# EAGLE design DMMRectifier_v2 (EAGLE 9.7.0)
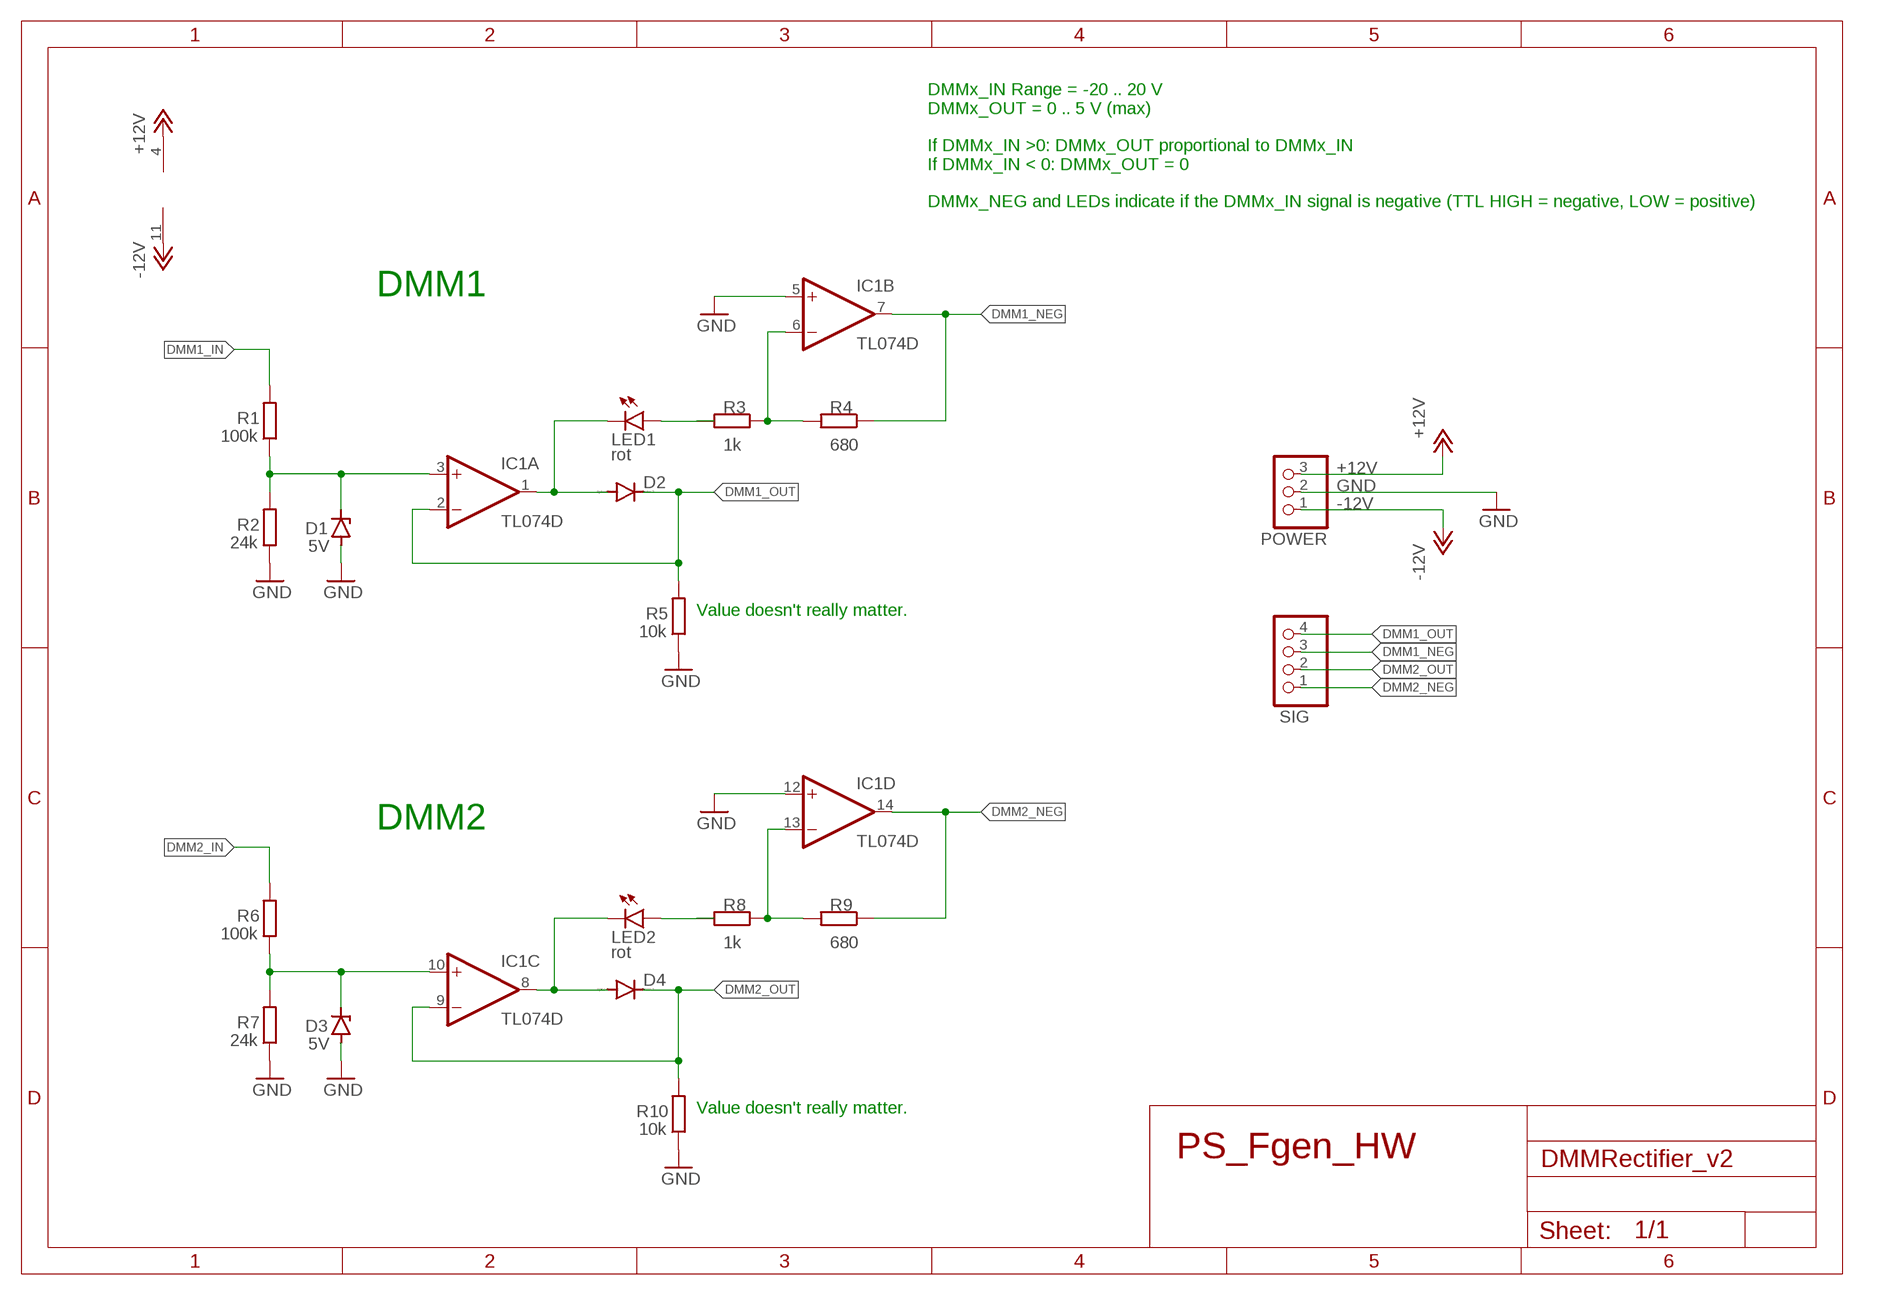
[diagram p0: schematic, sheet 1]

## Parts
D1  5V  ZENER-DIODESOD80C  [SOD80C]
D2  DIODE-SOD80C  [SOD80C]
D3  5V  ZENER-DIODESOD80C  [SOD80C]
D4  DIODE-SOD80C  [SOD80C]
IC1  TL074D  [SO14]
LED1  rot  LEDCHIPLED_0603  [CHIPLED_0603]
LED2  rot  LEDCHIPLED_0603  [CHIPLED_0603]
POWER  PINHD-1X3  [1X03]
R1  100k  R-EU_R0805  [R0805]
R2  24k  R-EU_R0805  [R0805]
R3  1k  R-EU_R0805  [R0805]
R4  680  R-EU_R0805  [R0805]
R5  10k  R-EU_R0805  [R0805]
R6  100k  R-EU_R0805  [R0805]
R7  24k  R-EU_R0805  [R0805]
R8  1k  R-EU_R0805  [R0805]
R9  680  R-EU_R0805  [R0805]
R10  10k  R-EU_R0805  [R0805]
SIG  PINHD-1X4  [1X04]

## Nets
+12V: IC1.4(P:V+) POWER.3
-12V: IC1.11(P:V-) POWER.1
DMM1_IN: R1.2
DMM1_NEG: IC1.7(B:OUT) R4.1 SIG.3
DMM1_OUT: D2.C IC1.2(A:-IN) R5.2 SIG.4
DMM2_IN: R6.2
DMM2_NEG: IC1.14(D:OUT) R9.1 SIG.1
DMM2_OUT: D4.C IC1.9(C:-IN) R10.2 SIG.2
GND: D1.A D3.A IC1.5(B:+IN) IC1.12(D:+IN) POWER.2 R2.1 R5.1 R7.1 R10.1
N$1: D1.C IC1.3(A:+IN) R1.1 R2.2
N$2: D3.C IC1.10(C:+IN) R6.1 R7.2
N$3: IC1.6(B:-IN) R3.1 R4.2
N$4: D2.A IC1.1(A:OUT) LED1.C
N$5: LED1.A R3.2
N$6: IC1.13(D:-IN) R8.1 R9.2
N$7: D4.A IC1.8(C:OUT) LED2.C
N$8: LED2.A R8.2

## Notes on the sheet
- DMMx_IN Range = -20 .. 20 V
  DMMx_OUT = 0 .. 5 V (max)
  
  If DMMx_IN >0: DMMx_OUT proportional to DMMx_IN
  If DMMx_IN < 0: DMMx_OUT = 0
  
  DMMx_NEG and LEDs indicate if the DMMx_IN signal is negative (TTL HIGH = negative, LOW = positive)
- DMM1
- Value doesn't really matter.
- DMM2
- Value doesn't really matter.
- PS_Fgen_HW

## Library data of the parts
D1 D3 = diode:ZENER-DIODE: Z-Diode
D2 D4 = diode:DIODE-: DIODE
IC1 = linear:TL074: OP AMP; SPICEPREFIX: I
LED1 LED2 = OwnDevices:LED: LED OSRAM: - CHIPLED LG R971, LG N971, LY N971, LG Q971, LY Q971, LO R971, LY R971 LH N974, LH R974 LS Q976, LO Q976, LY Q976 LO Q996 - Hyper CHIPLED LW Q18S LB Q993, LB Q99A, LB R99A - SideLED LS A670, LO A670, LY A670, LG A670, LP A670 LB A673, LV A673, LT A673, LW A673 LH A674 LY A675 LS A676, LA A676, LO A676, LY A676, LW A676 LS A679, LY A679, LG A679 - Hyper Micro SIDELED® LS Y876, LA Y876, LO Y876, LY Y876 LT Y87S - SmartLED LW L88C, LW L88S LB L89C, LB L89S, LG L890 LS L89K, LO L89K, LY L89K LS L896, LA L896, LO L896, LY L896 - TOPLED LS T670, LO T670, LY T670, LG T670, LP T670 LSG T670, LSP T670, LSY T670, LOP T670, LYG T670 LG T671, LOG T671, LSG T671 LB T673, LV T673, LT T673, LW T673 LH T674 LS T676, LA T676, LO T676, LY T676, LB T676, LH T676, LSB T676, LW T676 LB T67C, LV T67C, LT T67C, LS T67K, LO T67K, LY T67K, LW E67C LS E67B, LA E67B, LO E67B, LY E67B, LB E67C, LV E67C, LT E67C LW T67C LS T679, LY T679, LG T679 LS T770, LO T770, LY T770, LG T770, LP T770 LB T773, LV T773, LT T773, LW T773 LH T774 LS E675, LA E675, LY E675, LS T675 LS T776, LA T776, LO T776, LY T776, LB T776 LHGB T686 LT T68C, LB T68C - Hyper Mini TOPLED® LB M676 - Mini TOPLED Santana® LG M470 LS M47K, LO M47K, LY M47K Source: http://www.osram.convergy.de LUXEON: - LUMILED® LXK2-PW12-R00, LXK2-PW12-S00, LXK2-PW14-U00, LXK2-PW14-V00 LXK2-PM12-R00, LXK2-PM12-S00, LXK2-PM14-U00 LXK2-PE12-Q00, LXK2-PE12-R00, LXK2-PE12-S00, LXK2-PE14-T00, LXK2-PE14-U00 LXK2-PB12-K00, LXK2-PB12-L00, LXK2-PB12-M00, LXK2-PB14-N00, LXK2-PB14-P00, LXK2-PB14-Q00 LXK2-PR12-L00, LXK2-PR12-M00, LXK2-PR14-Q00, LXK2-PR14-R00 LXK2-PD12-Q00, LXK2-PD12-R00, LXK2-PD12-S00 LXK2-PH12-R00, LXK2-PH12-S00 LXK2-PL12-P00, LXK2-PL12-Q00, LXK2-PL12-R00 Source: www.luxeon.com KINGBRIGHT: KA-3528ASYC Source: www.kingbright.com
POWER = pinhead:PINHD-1X3: PIN HEADER
R1-R10 = OwnDevices:R-EU_: RESISTOR, European symbol; SPICEPREFIX: R
SIG = pinhead:PINHD-1X4: PIN HEADER

## Net classes
0 default: width 0.508 mm

## Board
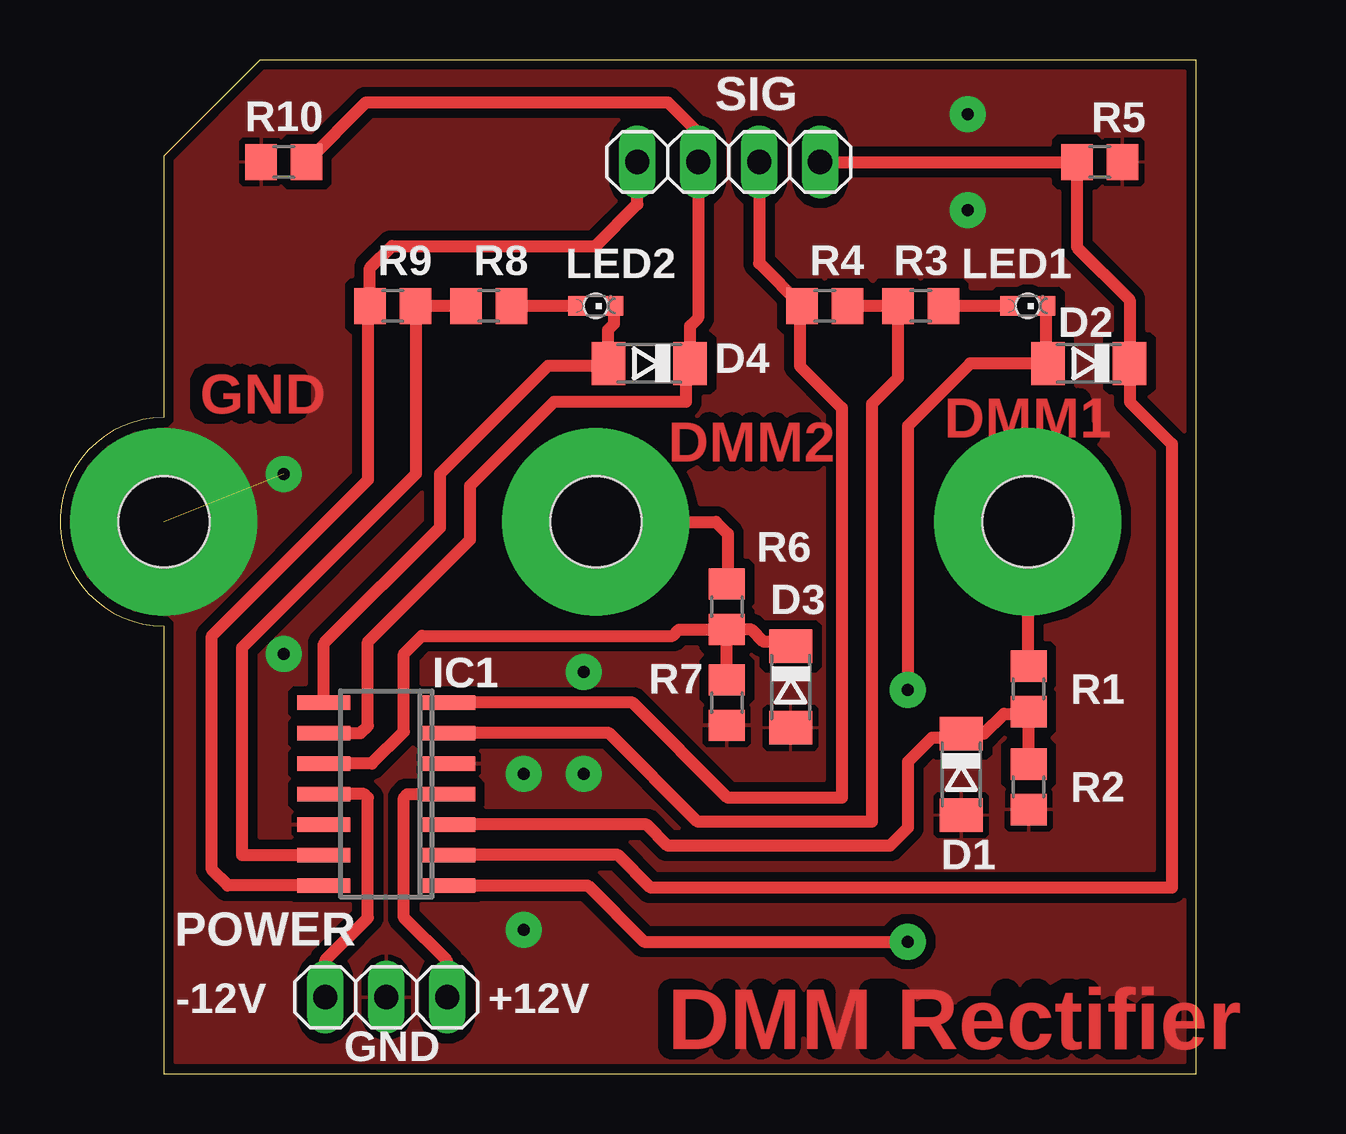
[diagram p1: board, top side]
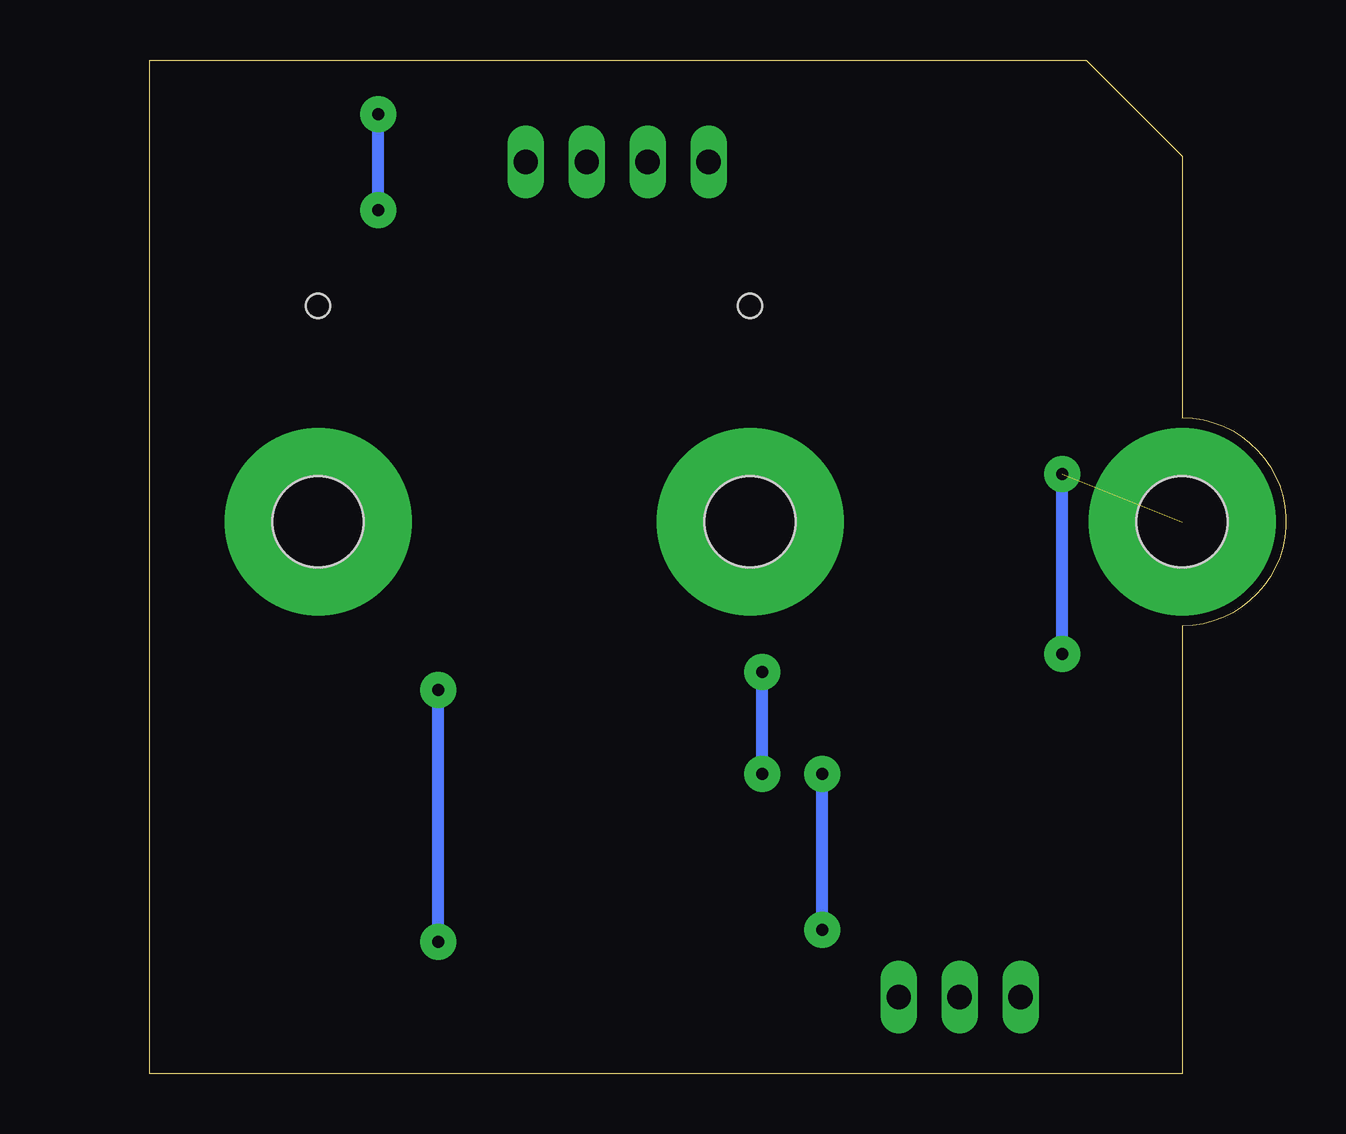
[diagram p2: board, bottom side, seen from below]

Size 47.34 x 42.25 mm. Coordinates in mm from the lower left corner, seen from the top.
Outline: 4.32,38.25 4.32,27.34 arc180 4.32,18.66 4.32,0 47.34,0 47.34,42.25 8.32,42.25 4.32,38.25
Copper layers (1*16): Top / Bottom
Stack-up Default Layer Stack: Top User Defined 0.035mm / Dielectric-1 User Defined 1.5mm / Bottom User Defined 0.035mm
Design rules: minimum copper width class=0 20mil, minimum copper width 10mil, minimum drill size 0.35mm, copper clearance wire_polygon to wire_polygon 10mil, copper clearance wire_polygon to pad_smd 10mil, copper clearance wire_polygon to via 10mil, copper clearance pad_smd to pad_smd 10mil, copper clearance pad_smd to via 10mil, copper clearance via to via 10mil, copper clearance smd to pad (same net) 10mil, copper clearance smd to via (same net) 10mil, copper clearance smd to smd (same net) 6mil, dimension clearance 5mil, via restrict clearance 0mil, restrict clearance 0mil, drill distance 6mil, keepout clearance 0mil
Holes 3.8 mm at 4.34,23 40.34,23 22.34,23
Holes 1 mm at 22.32,32 40.32,32

### Footprints (pad centres in the part's own frame; a part is rotated, then mirrored left to right if it is on the bottom)
SOD80C = smd 1.4 x 1.8: A 1.7,0; C -1.7,0
SO14 = smd 0.6 x 2.2: 1 -3.81,-2.6; 2 -2.54,-2.6; 3 -1.27,-2.6; 4 0,-2.6; 5 1.27,-2.6; 6 2.54,-2.6; 7 3.81,-2.6; 8 3.81,2.6; 9 2.54,2.6; 10 1.27,2.6; 11 0,2.6; 12 -1.27,2.6; 13 -2.54,2.6; 14 -3.81,2.6
CHIPLED_0603 = smd 0.8 x 0.8: A 0,-0.75; C 0,0.75
1X03 = drill 1.016 long: 1 -2.54,0; 2 0,0; 3 2.54,0
R0805 = smd 1.3 x 1.5: 1 -0.95,0; 2 0.95,0
1X04 = drill 1.016 long: 1 -3.81,0; 2 -1.27,0; 3 1.27,0; 4 3.81,0

### Placement (x,y rotation side)
D1  37.55,12.47 270 top
D2  42.86,29.6 180 top
D3  30.44,16.11 270 top
D4  24.55,29.6 180 top
IC1  13.59,11.65 90 top
LED1  40.32,32 270 top
LED2  22.32,32 270 top
POWER  13.59,3.18 0 top
R1  40.36,16.03 90 top
R2  40.36,11.95 90 top
R3  35.86,32 0 top
R4  31.86,32 0 top
R5  43.32,38 180 top
R6  27.78,19.46 90 top
R7  27.78,15.46 90 top
R8  17.86,32 0 top
R9  13.86,32 0 top
R10  9.32,38 0 top
SIG  27.86,38 0 top

### Tracks (layer width: path | path; a pad name or v marks a point on that pad's centre or on a via)
+12V
  Top 0.508: POWER.3 16.13,4.69 14.32,6.5 14.32,11.5 14.47,11.65 IC1.4
-12V
  Top 0.508: POWER.1 11.05,4.73 12.82,6.5 12.82,11.5 12.67,11.65 IC1.11
DMM1_IN  (via drill 3.8 pad 7.8)
  Top 0.508: v40.32,23 40.32,17.02 R1.2
DMM1_NEG
  Top 0.508: SIG.3 29.13,33.78 R4.1 30.82,31.75 30.82,29.5 32.57,27.75 32.57,11.5 27.82,11.5 23.86,15.46 IC1.7
DMM1_OUT
  Top 0.508: SIG.4 R5.2 42.37,34.45 44.56,32.26 D2.C 44.57,29.5 44.57,28 46.32,26.25 46.32,7.75 24.62,7.75 23.26,9.11 IC1.2
DMM2_IN  (via drill 3.8 pad 7.8)
  Top 0.508: v22.32,23 27.32,23 27.82,22.5 27.82,20.45 R6.2
DMM2_NEG
  Top 0.508: SIG.1 24.05,36.23 22.32,34.5 13.82,34.5 12.91,33.59 R9.1 12.82,31.75 12.82,24.75 6.32,18.25 6.32,8.5 6.98,7.84 IC1.14
DMM2_OUT
  Top 0.508: R10.2 12.75,40.48 25.32,40.48 26.59,39.21 SIG.2 26.59,31.5 26.25,31.16 D4.C 26.07,29.42 26.07,28 20.57,28 17.07,24.5 17.07,22.25 12.82,18 12.82,14.5 12.51,14.19 IC1.9
GND  (via drill 0.5 pad 1.5, 3.8 pad 7.8)  (1 unrouted)
  Bottom 0.508: v9.32,17.5 v9.32,25 | v21.82,12.5 v21.82,16.75 | v19.32,6 v19.32,12.5 | v37.82,36 v37.82,40
  other vias: 4.32,23
  pour Top (isolate 0.406): 47.4,42.58 -0.75,42.58 -0.75,-0.08 47.4,-0.08
N$1
  Top 0.508: R1.1 40.36,15 | IC1.3 24.44,10.38 25.32,9.5 34.57,9.5 35.32,10.25 35.32,13 36.32,14 37.38,14 D1.C 38.49,14.17 39.32,15 40.36,15 | R2.2 40.36,15
N$2
  Top 0.508: IC1.10 12.99,12.92 14.32,14.25 14.32,17.5 15.07,18.25 25.52,18.25 25.78,18.51 R6.1 | D3.C 30.25,18 29.32,18 28.81,18.51 R6.1 | R7.2 R6.1
N$3
  Top 0.508: R4.2 R3.1 34.91,29 33.82,27.91 33.82,10.5 26.57,10.5 22.88,14.19 IC1.6
N$4  (via drill 0.5 pad 1.5)
  Top 0.508: LED1.C 41.07,29.69 D2.A 37.92,29.6 35.32,27 v35.32,16 | IC1.1 21.98,7.84 24.32,5.5 v35.32,5.5
  Bottom 0.508: v35.32,5.5 v35.32,16
N$5
  Top 0.508: LED1.A R3.2
N$6
  Top 0.508: R8.1 R9.2 14.82,31.75 14.82,25 7.57,17.75 7.57,9.11 IC1.13
N$7
  Top 0.508: LED2.C 23.07,31.25 22.82,31 22.82,29.29 D4.A 22.77,29.5 20.32,29.5 15.82,25 15.82,22.75 10.99,17.92 IC1.8
N$8
  Top 0.508: LED2.A R8.2

### Text on the board
Top: GND | DMM2 | DMM1 | DMM Rectifier
tNames: -12V | +12V | GND